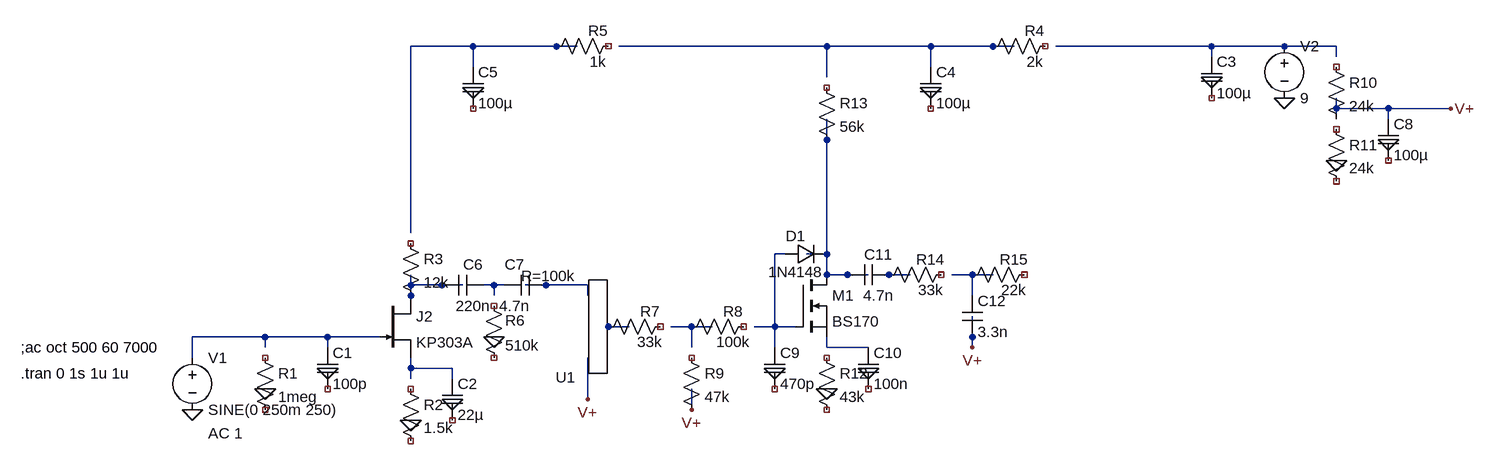
[diagram p0: schematic engl3.asc]
engl3.asc, the LTspice schematic file:
Version 4
SHEET 1 1732 680
WIRE 176 -224 80 -224
WIRE 336 -224 176 -224
WIRE 720 -224 400 -224
WIRE 880 -224 720 -224
WIRE 1008 -224 880 -224
WIRE 1312 -224 1072 -224
WIRE 1424 -224 1312 -224
WIRE 1504 -224 1424 -224
WIRE 1312 -208 1312 -224
WIRE 1504 -208 1504 -224
WIRE 176 -192 176 -224
WIRE 880 -192 880 -224
WIRE 720 -176 720 -224
WIRE 1504 -128 1504 -144
WIRE 1584 -128 1504 -128
WIRE 1680 -128 1584 -128
WIRE 1504 -112 1504 -128
WIRE 1584 -112 1584 -128
WIRE 80 64 80 -224
WIRE 656 96 640 96
WIRE 720 96 720 -112
WIRE 720 96 688 96
WIRE 720 128 720 96
WIRE 784 128 720 128
WIRE 848 128 816 128
WIRE 944 128 912 128
WIRE 976 128 944 128
WIRE 80 144 80 128
WIRE 160 144 80 144
WIRE 208 144 192 144
WIRE 224 144 208 144
WIRE 352 144 256 144
WIRE 80 160 80 144
WIRE 208 160 208 144
WIRE 352 160 352 144
WIRE 944 160 944 128
WIRE 416 208 384 208
WIRE 512 208 480 208
WIRE 544 208 512 208
WIRE 640 208 640 96
WIRE 640 208 608 208
WIRE 672 208 640 208
WIRE -144 224 -256 224
WIRE -48 224 -144 224
WIRE 32 224 -48 224
WIRE -144 240 -144 224
WIRE -48 240 -48 224
WIRE 512 240 512 208
WIRE 640 240 640 208
WIRE 720 240 720 224
WIRE 784 240 720 240
WIRE 944 240 944 192
WIRE -256 256 -256 224
WIRE 80 272 80 256
WIRE 144 272 80 272
WIRE 80 288 80 272
WIRE 144 288 144 272
WIRE 352 320 352 256
WIRE 512 336 512 304
FLAG -256 336 0
FLAG -144 304 0
FLAG -48 272 0
FLAG 80 352 0
FLAG 144 320 0
FLAG 176 -160 0
FLAG 208 224 0
FLAG 1312 -176 0
FLAG 880 -160 0
FLAG 1424 -144 0
FLAG 1680 -128 V+
FLAG 1584 -80 0
FLAG 1504 -48 0
FLAG 352 320 V+
FLAG 512 336 V+
FLAG 640 272 0
FLAG 784 272 0
FLAG 720 304 0
FLAG 944 240 V+
SYMBOL voltage -256 240 R0
WINDOW 123 24 132 Left 0
WINDOW 39 0 0 Left 0
SYMATTR Value2 AC 1
SYMATTR InstName V1
SYMATTR Value SINE(0 250m 250)
SYMBOL voltage 1424 -240 R0
WINDOW 123 0 0 Left 0
WINDOW 39 0 0 Left 0
SYMATTR InstName V2
SYMATTR Value 9
SYMBOL res -160 240 R0
SYMATTR InstName R1
SYMATTR Value 1meg
SYMBOL cap -64 240 R0
SYMATTR InstName C1
SYMATTR Value 100p
SYMBOL njf 32 160 R0
SYMATTR InstName J2
SYMATTR Value KP303A
SYMBOL res 64 288 R0
SYMATTR InstName R2
SYMATTR Value 1.5k
SYMBOL cap 128 288 R0
SYMATTR InstName C2
SYMATTR Value 22µ
SYMBOL res 64 64 R0
SYMATTR InstName R3
SYMATTR Value 12k
SYMBOL res 1072 -240 R90
WINDOW 0 8 32 VBottom 0
WINDOW 3 24 32 VTop 0
SYMATTR InstName R4
SYMATTR Value 2k
SYMBOL res 400 -240 R90
WINDOW 0 8 32 VBottom 0
WINDOW 3 24 32 VTop 0
SYMATTR InstName R5
SYMATTR Value 1k
SYMBOL cap 1296 -208 R0
SYMATTR InstName C3
SYMATTR Value 100µ
SYMBOL cap 864 -192 R0
SYMATTR InstName C4
SYMATTR Value 100µ
SYMBOL cap 160 -192 R0
SYMATTR InstName C5
SYMATTR Value 100µ
SYMBOL cap 192 128 R90
WINDOW 0 0 16 VBottom 0
WINDOW 3 32 16 VTop 0
SYMATTR InstName C6
SYMATTR Value 220n
SYMBOL res 192 160 R0
WINDOW 0 33 38 Left 0
WINDOW 3 33 77 Left 0
SYMATTR InstName R6
SYMATTR Value 510k
SYMBOL cap 224 160 R270
WINDOW 0 32 16 VTop 0
WINDOW 3 0 16 VBottom 0
SYMATTR InstName C7
SYMATTR Value 4.7n
SYMBOL EXTRA\\Misc\\pot 352 208 R180
SYMATTR InstName U1
SYMATTR Value R=100k
SYMBOL res 480 192 R90
WINDOW 0 8 32 VBottom 0
WINDOW 3 24 32 VTop 0
SYMATTR InstName R7
SYMATTR Value 33k
SYMBOL res 608 192 R90
WINDOW 0 8 32 VBottom 0
WINDOW 3 24 32 VTop 0
SYMATTR InstName R8
SYMATTR Value 100k
SYMBOL res 496 240 R0
SYMATTR InstName R9
SYMATTR Value 47k
SYMBOL res 1488 -208 R0
SYMATTR InstName R10
SYMATTR Value 24k
SYMBOL res 1488 -112 R0
SYMATTR InstName R11
SYMATTR Value 24k
SYMBOL cap 1568 -112 R0
SYMATTR InstName C8
SYMATTR Value 100µ
SYMBOL nmos 672 128 R0
SYMATTR InstName M1
SYMATTR Value BS170
SYMBOL cap 624 240 R0
SYMATTR InstName C9
SYMATTR Value 470p
SYMBOL diode 656 112 R270
WINDOW 0 28 16 VTop 0
WINDOW 3 4 16 VBottom 0
SYMATTR InstName D1
SYMATTR Value 1N4148
SYMBOL res 704 240 R0
SYMATTR InstName R12
SYMATTR Value 43k
SYMBOL cap 768 240 R0
SYMATTR InstName C10
SYMATTR Value 100n
SYMBOL res 704 -176 R0
SYMATTR InstName R13
SYMATTR Value 56k
SYMBOL cap 816 112 R90
WINDOW 0 0 16 VBottom 0
WINDOW 3 32 16 VTop 0
SYMATTR InstName C11
SYMATTR Value 4.7n
SYMBOL res 912 112 R90
WINDOW 0 8 32 VBottom 0
WINDOW 3 24 32 VTop 0
SYMATTR InstName R14
SYMATTR Value 33k
SYMBOL res 1040 112 R90
WINDOW 0 8 32 VBottom 0
WINDOW 3 24 32 VTop 0
SYMATTR InstName R15
SYMATTR Value 22k
SYMBOL cap 928 160 R0
SYMATTR InstName C12
SYMATTR Value 3.3n
TEXT -520 240 Left 0 !;ac oct 500 60 7000
TEXT -520 280 Left 0 !.tran 0 1s 1u 1u

The netlist it stands for:
* engl3.asc
V1 N013 0 SINE(0 250m 250) AC 1
V2 N003 0 9
R1 NC_01 NC_02 1meg
C1 N013 NC_03 100p
J2 N008 N013 N015 KP303A
R2 NC_04 NC_05 1.5k
C2 N015 NC_06 22µ
R3 NC_07 N008 12k
R4 NC_08 N002 2k
R5 NC_09 N001 1k
C3 N003 NC_10 100µ
C4 N002 NC_11 100µ
C5 N001 NC_12 100µ
C6 N009 N008 220n
R6 NC_13 NC_14 510k
C7 N009 N010 4.7n
XU1 V+ N010 N011 R=100k
R7 NC_15 N011 33k
R8 NC_16 N012 100k
R9 NC_17 V+ 47k
R10 NC_18 V+ 24k
R11 NC_19 NC_20 24k
C8 V+ NC_21 100µ
M1 N005 N004 N014 N014 BS170
C9 N004 NC_22 470p
D1 N004 N005 1N4148
R12 NC_23 NC_24 43k
C10 N014 NC_25 100n
R13 NC_26 N005 56k
C11 N006 N005 4.7n
R14 NC_27 N006 33k
R15 NC_28 N007 22k
C12 N007 V+ 3.3n
.model D D
.lib standard.dio
.model NJF NJF
.model PJF PJF
.lib standard.jft
.model NMOS NMOS
.model PMOS PMOS
.lib standard.mos
;ac oct 500 60 7000
.tran 0 1s 1u 1u
.lib POT.lib
.backanno
.end